# Altium schematic sheet top.SchDoc: GECKO3main: System overview
size A3; Organization: Berne University of Applied Science; Address1: School of Engineering and; Address2: Information Technology; Address3: Quellgasse 21; Address4: CH-2501 Biel; Revision: 1.0; SheetNumber: 1; SheetTotal: 19; ApprovedBy: zem1; Author: zac1
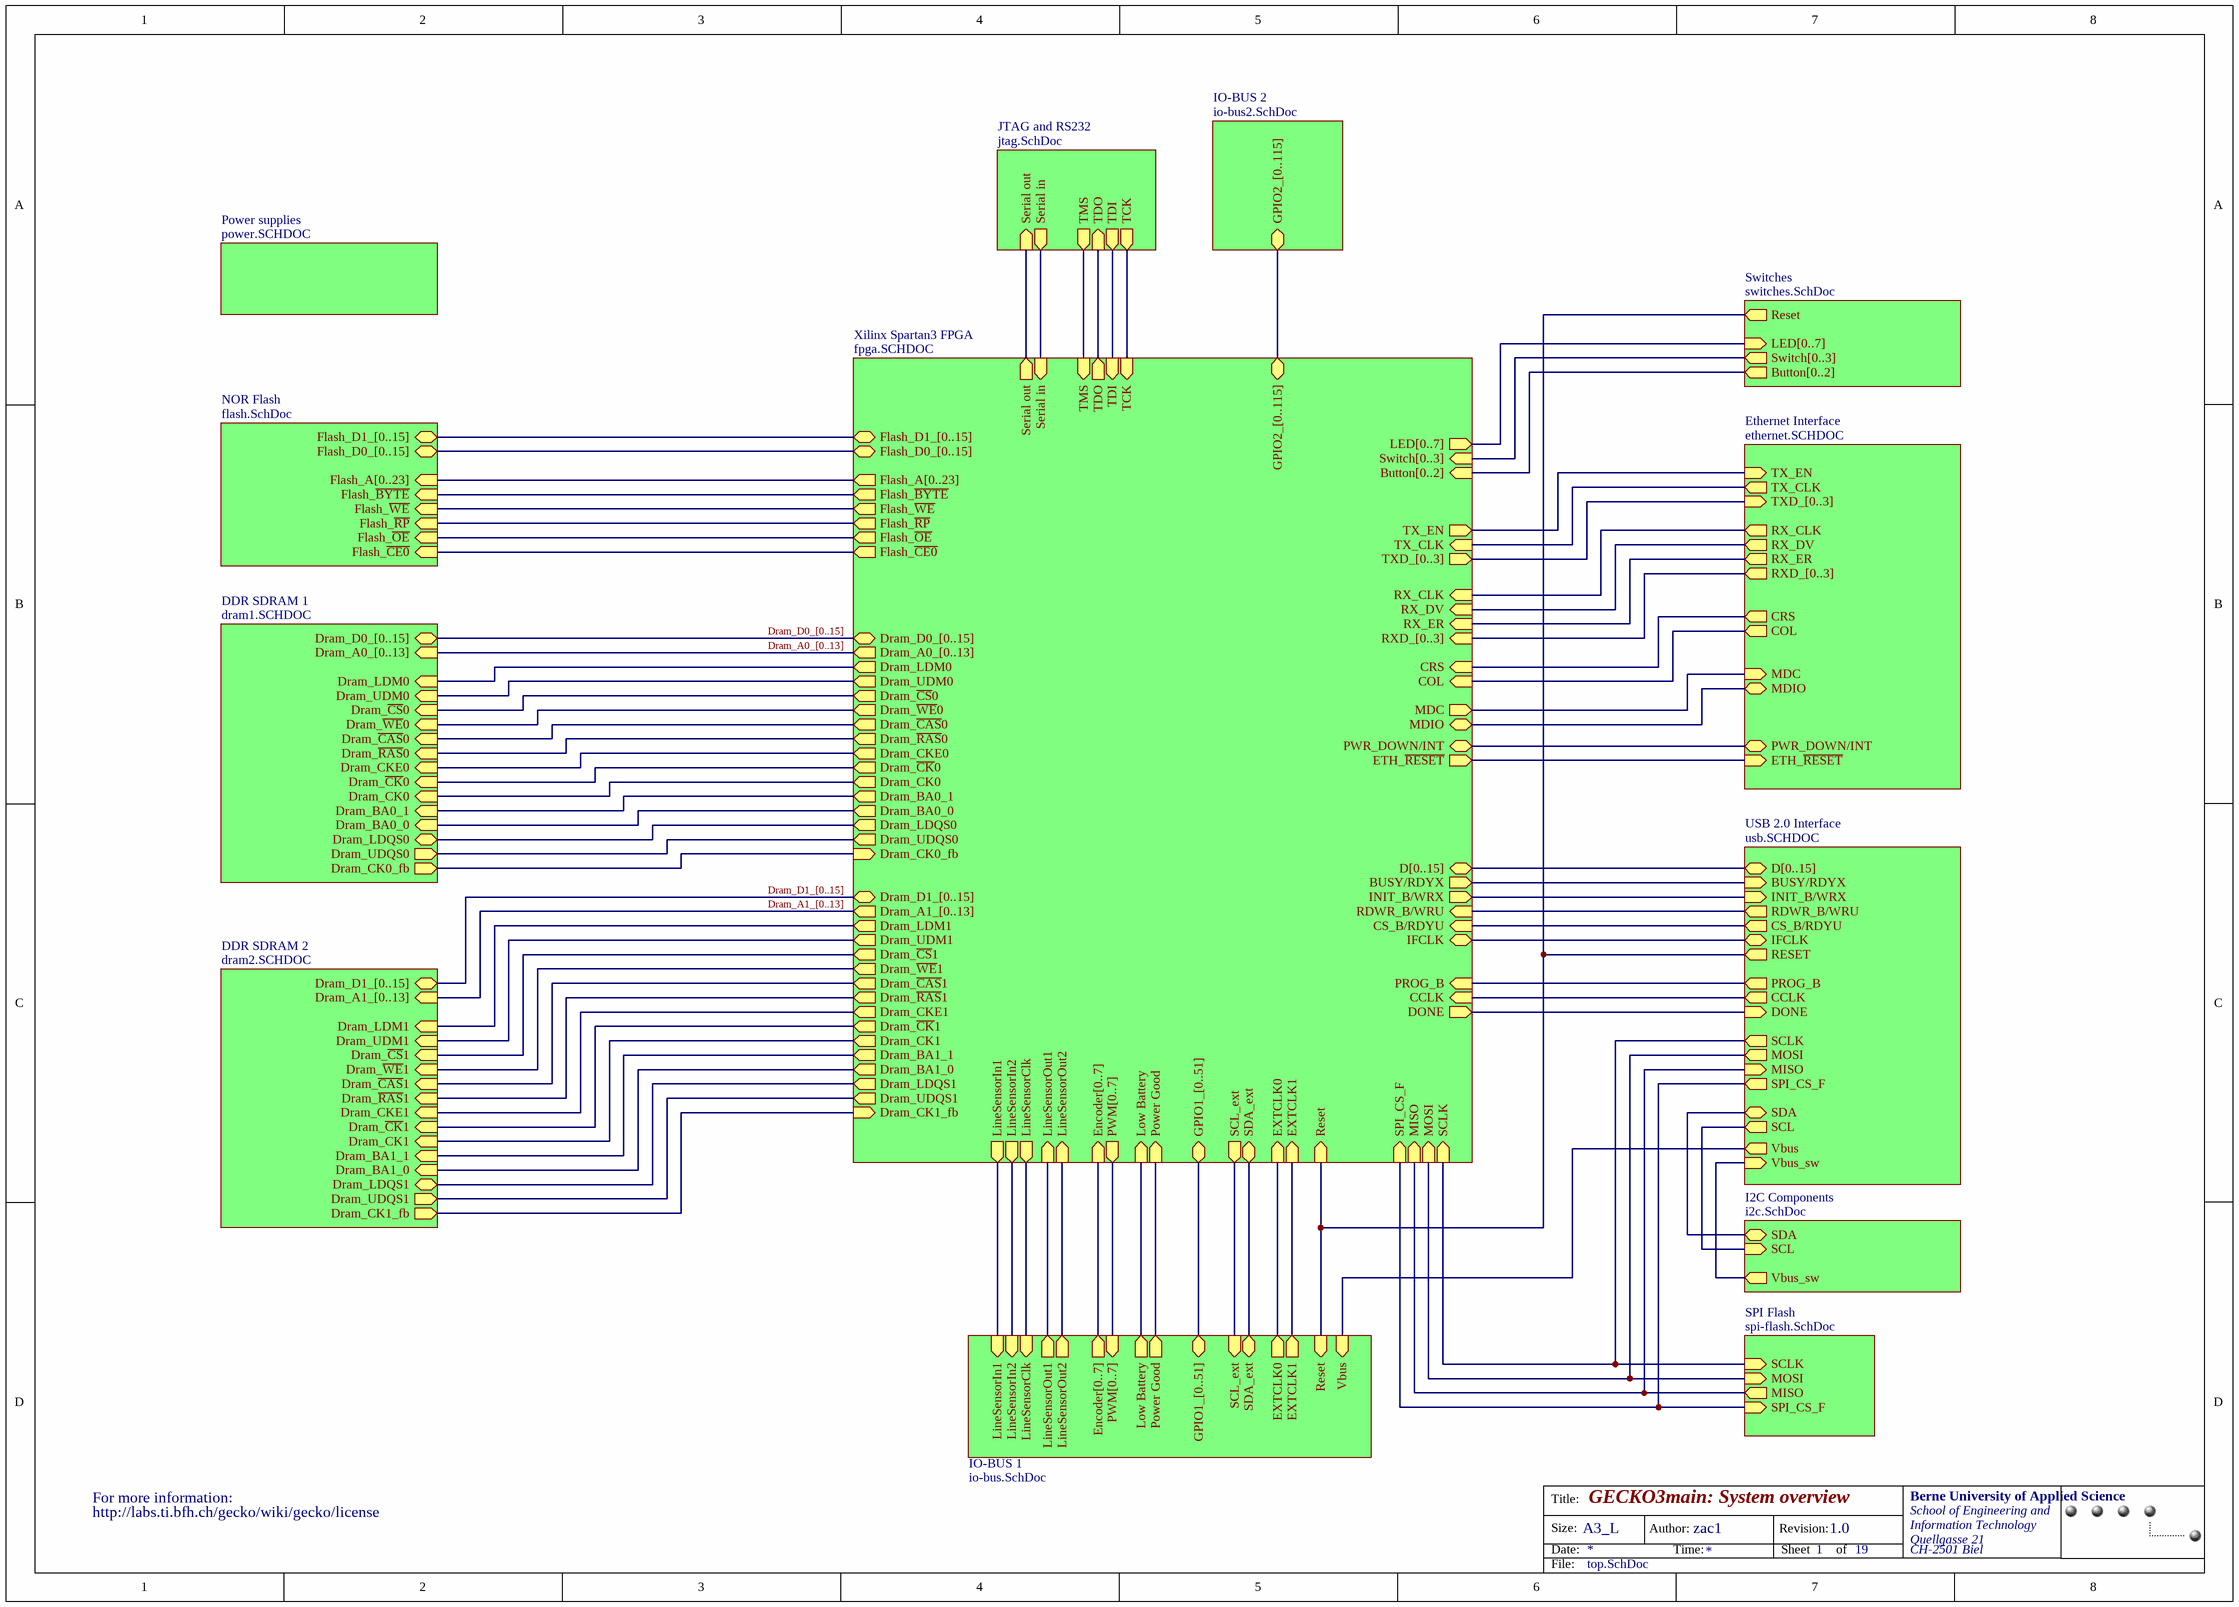
[diagram p0: top.SchDoc]

## Parts
1  (no value)  [CC-License]

## Sub-sheets
DDR SDRAM 1 = dram1.SCHDOC: Dram_D0_[0..15] (bidir), Dram_A0_[0..13] (in), Dram_LDM0 (in), Dram_UDM0 (in), Dram_~{CS}0 (in), Dram_~{WE}0 (in), Dram_~{CAS}0 (in), Dram_~{RAS}0 (in), Dram_CKE0 (in), Dram_~{CK}0 (in), Dram_CK0 (in), Dram_BA0_1 (in), Dram_BA0_0 (in), Dram_LDQS0 (bidir), Dram_UDQS0 (out), Dram_CK0_fb (out)
DDR SDRAM 2 = dram2.SCHDOC: Dram_D1_[0..15] (bidir), Dram_A1_[0..13] (in), Dram_LDM1 (in), Dram_UDM1 (in), Dram_~{CS}1 (in), Dram_~{WE}1 (in), Dram_~{CAS}1 (in), Dram_~{RAS}1 (in), Dram_CKE1 (in), Dram_~{CK}1 (in), Dram_CK1 (in), Dram_BA1_1 (in), Dram_BA1_0 (in), Dram_LDQS1 (bidir), Dram_UDQS1 (out), Dram_CK1_fb (out)
Ethernet Interface = ethernet.SCHDOC: PWR_DOWN/INT (bidir), ETH_~{RESET} (in), TX_CLK (out), RXD_[0..3] (out), RX_CLK (out), RX_DV (out), RX_ER (out), CRS (out), COL (out), TX_EN (in), TXD_[0..3] (in), MDC (in), MDIO (bidir)
I2C Components = i2c.SchDoc: SDA (bidir), SCL (in), Vbus_sw (out)
IO-BUS 1 = io-bus.SchDoc: Vbus (in), PWM[0..7] (in), GPIO1_[0..51] (bidir), Encoder[0..7] (out), Power Good (out), Low Battery (out), SDA_ext (bidir), Reset (in), SCL_ext (in), EXTCLK0 (out), EXTCLK1 (out), LineSensorOut2 (out), LineSensorOut1 (out), LineSensorIn2 (in), LineSensorClk (in), LineSensorIn1 (in)
IO-BUS 2 = io-bus2.SchDoc: GPIO2_[0..115] (bidir)
JTAG and RS232 = jtag.SchDoc: TCK (out), TDI (out), TMS (out), TDO (in), Serial out (in), Serial in (out)
NOR Flash = flash.SchDoc: Flash_A[0..23] (in), Flash_~{BYTE} (in), Flash_~{WE} (in), Flash_~{RP} (in), Flash_~{OE} (in), Flash_~{CE0} (in), Flash_D0_[0..15] (bidir), Flash_D1_[0..15] (bidir)
Power supplies = power.SCHDOC: no entries
SPI Flash = spi-flash.SchDoc: MOSI (in), SPI_CS_F (in), SCLK (in), MISO (out)
Switches = switches.SchDoc: LED[0..7] (in), Button[0..2] (out), Switch[0..3] (out), Reset (out)
USB 2.0 Interface = usb.SCHDOC: D[0..15] (bidir), Vbus (out), DONE (in), INIT_B/WRX (in), PROG_B (out), RDWR_B/WRU (out), BUSY/RDYX (in), RESET (out), CS_B/RDYU (out), CCLK (out), MISO (in), SPI_CS_F (out), MOSI (out), SCLK (out), SDA (bidir), SCL (out), Vbus_sw (in), IFCLK (bidir)
Xilinx Spartan3 FPGA = fpga.SCHDOC: PWR_DOWN/INT (bidir), ETH_~{RESET} (out), Flash_D1_[0..15] (bidir), Power Good (in), Low Battery (in), Flash_D0_[0..15] (bidir), Flash_~{BYTE} (out), Flash_~{WE} (out), Flash_~{RP} (out), Flash_~{OE} (out), Flash_~{CE0} (out), SDA_ext (bidir), SCL_ext (out), PWM[0..7] (out), GPIO1_[0..51] (bidir), Encoder[0..7] (in), GPIO2_[0..115] (bidir), Flash_A[0..23] (out), MOSI (in), SCLK (in), MISO (in), SPI_CS_F (in), Dram_D1_[0..15] (bidir), Dram_A1_[0..13] (out), Dram_LDM1 (out), Dram_UDM1 (out), Dram_~{CS}1 (out), Dram_~{WE}1 (out), Dram_~{CAS}1 (out), Dram_~{RAS}1 (out), Dram_CKE1 (out), Dram_~{CK}1 (out), Dram_CK1 (out), Dram_BA1_1 (out), Dram_BA1_0 (out), Dram_LDQS1 (out), Dram_UDQS1 (out), LED[0..7] (out), Button[0..2] (in), Switch[0..3] (in), TX_CLK (in), RXD_[0..3] (in), RX_CLK (in), RX_DV (in), RX_ER (in), CRS (in), COL (in), TX_EN (out), TXD_[0..3] (out), MDC (out), MDIO (bidir), D[0..15] (bidir), DONE (out), INIT_B/WRX (out), PROG_B (in), RDWR_B/WRU (in), BUSY/RDYX (out), CS_B/RDYU (in), CCLK (in), Dram_D0_[0..15] (bidir), Dram_A0_[0..13] (out), Dram_LDM0 (out), Dram_UDM0 (out), Dram_~{CS}0 (out), Dram_~{WE}0 (out), Dram_~{CAS}0 (out), Dram_~{RAS}0 (out), Dram_CKE0 (out), Dram_~{CK}0 (out), Dram_CK0 (out), Dram_BA0_1 (out), Dram_BA0_0 (out), Dram_LDQS0 (out), Dram_UDQS0 (out), EXTCLK0 (in), EXTCLK1 (in), TCK (in), TDI (in), TMS (in), TDO (out), Serial out (out), Serial in (in), Reset (in), IFCLK (bidir), Dram_CK1_fb (in), Dram_CK0_fb (in), LineSensorOut2 (in), LineSensorOut1 (in), LineSensorIn2 (out), LineSensorClk (out), LineSensorIn1 (out)

## Nets
(unnamed): sheet Xilinx Spartan3 FPGA/PWR_DOWN/INT, sheet Ethernet Interface/PWR_DOWN/INT
(unnamed): sheet Xilinx Spartan3 FPGA/ETH_~{RESET}, sheet Ethernet Interface/ETH_~{RESET}
(unnamed): sheet Xilinx Spartan3 FPGA/Power Good, sheet IO-BUS 1/Power Good
(unnamed): sheet Xilinx Spartan3 FPGA/Low Battery, sheet IO-BUS 1/Low Battery
(unnamed): sheet Xilinx Spartan3 FPGA/Flash_~{BYTE}, sheet NOR Flash/Flash_~{BYTE}
(unnamed): sheet Xilinx Spartan3 FPGA/Flash_~{WE}, sheet NOR Flash/Flash_~{WE}
(unnamed): sheet Xilinx Spartan3 FPGA/Flash_~{RP}, sheet NOR Flash/Flash_~{RP}
(unnamed): sheet Xilinx Spartan3 FPGA/Flash_~{OE}, sheet NOR Flash/Flash_~{OE}
(unnamed): sheet Xilinx Spartan3 FPGA/Flash_~{CE0}, sheet NOR Flash/Flash_~{CE0}
(unnamed): sheet Xilinx Spartan3 FPGA/SDA_ext, sheet IO-BUS 1/SDA_ext
(unnamed): sheet Xilinx Spartan3 FPGA/SCL_ext, sheet IO-BUS 1/SCL_ext
(unnamed): sheet Xilinx Spartan3 FPGA/MOSI, sheet SPI Flash/MOSI, sheet USB 2.0 Interface/MOSI
(unnamed): sheet Xilinx Spartan3 FPGA/SCLK, sheet SPI Flash/SCLK, sheet USB 2.0 Interface/SCLK
(unnamed): sheet Xilinx Spartan3 FPGA/MISO, sheet SPI Flash/MISO, sheet USB 2.0 Interface/MISO
(unnamed): sheet Xilinx Spartan3 FPGA/SPI_CS_F, sheet SPI Flash/SPI_CS_F, sheet USB 2.0 Interface/SPI_CS_F
(unnamed): sheet Xilinx Spartan3 FPGA/Dram_LDM1, sheet DDR SDRAM 2/Dram_LDM1
(unnamed): sheet Xilinx Spartan3 FPGA/Dram_UDM1, sheet DDR SDRAM 2/Dram_UDM1
(unnamed): sheet Xilinx Spartan3 FPGA/Dram_~{CS}1, sheet DDR SDRAM 2/Dram_~{CS}1
(unnamed): sheet Xilinx Spartan3 FPGA/Dram_~{WE}1, sheet DDR SDRAM 2/Dram_~{WE}1
(unnamed): sheet Xilinx Spartan3 FPGA/Dram_~{CAS}1, sheet DDR SDRAM 2/Dram_~{CAS}1
(unnamed): sheet Xilinx Spartan3 FPGA/Dram_~{RAS}1, sheet DDR SDRAM 2/Dram_~{RAS}1
(unnamed): sheet Xilinx Spartan3 FPGA/Dram_CKE1, sheet DDR SDRAM 2/Dram_CKE1
(unnamed): sheet Xilinx Spartan3 FPGA/Dram_~{CK}1, sheet DDR SDRAM 2/Dram_~{CK}1
(unnamed): sheet Xilinx Spartan3 FPGA/Dram_CK1, sheet DDR SDRAM 2/Dram_CK1
(unnamed): sheet Xilinx Spartan3 FPGA/Dram_BA1_1, sheet DDR SDRAM 2/Dram_BA1_1
(unnamed): sheet Xilinx Spartan3 FPGA/Dram_BA1_0, sheet DDR SDRAM 2/Dram_BA1_0
(unnamed): sheet Xilinx Spartan3 FPGA/Dram_LDQS1, sheet DDR SDRAM 2/Dram_LDQS1
(unnamed): sheet Xilinx Spartan3 FPGA/Dram_UDQS1, sheet DDR SDRAM 2/Dram_UDQS1
(unnamed): sheet Xilinx Spartan3 FPGA/TX_CLK, sheet Ethernet Interface/TX_CLK
(unnamed): sheet Xilinx Spartan3 FPGA/RX_CLK, sheet Ethernet Interface/RX_CLK
(unnamed): sheet Xilinx Spartan3 FPGA/RX_DV, sheet Ethernet Interface/RX_DV
(unnamed): sheet Xilinx Spartan3 FPGA/RX_ER, sheet Ethernet Interface/RX_ER
(unnamed): sheet Xilinx Spartan3 FPGA/CRS, sheet Ethernet Interface/CRS
(unnamed): sheet Xilinx Spartan3 FPGA/COL, sheet Ethernet Interface/COL
(unnamed): sheet Xilinx Spartan3 FPGA/TX_EN, sheet Ethernet Interface/TX_EN
(unnamed): sheet Xilinx Spartan3 FPGA/MDC, sheet Ethernet Interface/MDC
(unnamed): sheet Xilinx Spartan3 FPGA/MDIO, sheet Ethernet Interface/MDIO
(unnamed): sheet Xilinx Spartan3 FPGA/DONE, sheet USB 2.0 Interface/DONE
(unnamed): sheet Xilinx Spartan3 FPGA/INIT_B/WRX, sheet USB 2.0 Interface/INIT_B/WRX
(unnamed): sheet Xilinx Spartan3 FPGA/PROG_B, sheet USB 2.0 Interface/PROG_B
(unnamed): sheet Xilinx Spartan3 FPGA/RDWR_B/WRU, sheet USB 2.0 Interface/RDWR_B/WRU
(unnamed): sheet Xilinx Spartan3 FPGA/BUSY/RDYX, sheet USB 2.0 Interface/BUSY/RDYX
(unnamed): sheet Xilinx Spartan3 FPGA/CS_B/RDYU, sheet USB 2.0 Interface/CS_B/RDYU
(unnamed): sheet Xilinx Spartan3 FPGA/CCLK, sheet USB 2.0 Interface/CCLK
(unnamed): sheet Xilinx Spartan3 FPGA/Dram_LDM0, sheet DDR SDRAM 1/Dram_LDM0
(unnamed): sheet Xilinx Spartan3 FPGA/Dram_UDM0, sheet DDR SDRAM 1/Dram_UDM0
(unnamed): sheet Xilinx Spartan3 FPGA/Dram_~{CS}0, sheet DDR SDRAM 1/Dram_~{CS}0
(unnamed): sheet Xilinx Spartan3 FPGA/Dram_~{WE}0, sheet DDR SDRAM 1/Dram_~{WE}0
(unnamed): sheet Xilinx Spartan3 FPGA/Dram_~{CAS}0, sheet DDR SDRAM 1/Dram_~{CAS}0
(unnamed): sheet Xilinx Spartan3 FPGA/Dram_~{RAS}0, sheet DDR SDRAM 1/Dram_~{RAS}0
(unnamed): sheet Xilinx Spartan3 FPGA/Dram_CKE0, sheet DDR SDRAM 1/Dram_CKE0
(unnamed): sheet Xilinx Spartan3 FPGA/Dram_~{CK}0, sheet DDR SDRAM 1/Dram_~{CK}0
(unnamed): sheet Xilinx Spartan3 FPGA/Dram_CK0, sheet DDR SDRAM 1/Dram_CK0
(unnamed): sheet Xilinx Spartan3 FPGA/Dram_BA0_1, sheet DDR SDRAM 1/Dram_BA0_1
(unnamed): sheet Xilinx Spartan3 FPGA/Dram_BA0_0, sheet DDR SDRAM 1/Dram_BA0_0
(unnamed): sheet Xilinx Spartan3 FPGA/Dram_LDQS0, sheet DDR SDRAM 1/Dram_LDQS0
(unnamed): sheet Xilinx Spartan3 FPGA/Dram_UDQS0, sheet DDR SDRAM 1/Dram_UDQS0
(unnamed): sheet Xilinx Spartan3 FPGA/EXTCLK0, sheet IO-BUS 1/EXTCLK0
(unnamed): sheet Xilinx Spartan3 FPGA/EXTCLK1, sheet IO-BUS 1/EXTCLK1
(unnamed): sheet Xilinx Spartan3 FPGA/TCK, sheet JTAG and RS232/TCK
(unnamed): sheet Xilinx Spartan3 FPGA/TDI, sheet JTAG and RS232/TDI
(unnamed): sheet Xilinx Spartan3 FPGA/TMS, sheet JTAG and RS232/TMS
(unnamed): sheet Xilinx Spartan3 FPGA/TDO, sheet JTAG and RS232/TDO
(unnamed): sheet Xilinx Spartan3 FPGA/Serial out, sheet JTAG and RS232/Serial out
(unnamed): sheet Xilinx Spartan3 FPGA/Serial in, sheet JTAG and RS232/Serial in
(unnamed): sheet Xilinx Spartan3 FPGA/Reset, sheet IO-BUS 1/Reset, sheet Switches/Reset, sheet USB 2.0 Interface/RESET
(unnamed): sheet Xilinx Spartan3 FPGA/IFCLK, sheet USB 2.0 Interface/IFCLK
(unnamed): sheet Xilinx Spartan3 FPGA/Dram_CK1_fb, sheet DDR SDRAM 2/Dram_CK1_fb
(unnamed): sheet Xilinx Spartan3 FPGA/Dram_CK0_fb, sheet DDR SDRAM 1/Dram_CK0_fb
(unnamed): sheet Xilinx Spartan3 FPGA/LineSensorOut2, sheet IO-BUS 1/LineSensorOut2
(unnamed): sheet Xilinx Spartan3 FPGA/LineSensorOut1, sheet IO-BUS 1/LineSensorOut1
(unnamed): sheet Xilinx Spartan3 FPGA/LineSensorIn2, sheet IO-BUS 1/LineSensorIn2
(unnamed): sheet Xilinx Spartan3 FPGA/LineSensorClk, sheet IO-BUS 1/LineSensorClk
(unnamed): sheet Xilinx Spartan3 FPGA/LineSensorIn1, sheet IO-BUS 1/LineSensorIn1
(unnamed): sheet I2C Components/SDA, sheet USB 2.0 Interface/SDA
(unnamed): sheet I2C Components/SCL, sheet USB 2.0 Interface/SCL
(unnamed): sheet I2C Components/Vbus_sw, sheet USB 2.0 Interface/Vbus_sw
(unnamed): sheet IO-BUS 1/Vbus, sheet USB 2.0 Interface/Vbus

## Buses and harness runs
bus Dram_A0_[0..13] = sheet DDR SDRAM 1/Dram_A0_[0..13] = sheet Xilinx Spartan3 FPGA/Dram_A0_[0..13]
bus Dram_A1_[0..13] = sheet DDR SDRAM 2/Dram_A1_[0..13] = sheet Xilinx Spartan3 FPGA/Dram_A1_[0..13]
bus Dram_D0_[0..15] = sheet DDR SDRAM 1/Dram_D0_[0..15] = sheet Xilinx Spartan3 FPGA/Dram_D0_[0..15]
bus Dram_D1_[0..15] = sheet DDR SDRAM 2/Dram_D1_[0..15] = sheet Xilinx Spartan3 FPGA/Dram_D1_[0..15]
bus sheet Ethernet Interface/RXD_[0..3] = sheet Xilinx Spartan3 FPGA/RXD_[0..3]
bus sheet Ethernet Interface/TXD_[0..3] = sheet Xilinx Spartan3 FPGA/TXD_[0..3]
bus sheet IO-BUS 1/Encoder[0..7] = sheet Xilinx Spartan3 FPGA/Encoder[0..7]
bus sheet IO-BUS 1/GPIO1_[0..51] = sheet Xilinx Spartan3 FPGA/GPIO1_[0..51]
bus sheet IO-BUS 1/PWM[0..7] = sheet Xilinx Spartan3 FPGA/PWM[0..7]
bus sheet IO-BUS 2/GPIO2_[0..115] = sheet Xilinx Spartan3 FPGA/GPIO2_[0..115]
bus sheet NOR Flash/Flash_A[0..23] = sheet Xilinx Spartan3 FPGA/Flash_A[0..23]
bus sheet NOR Flash/Flash_D0_[0..15] = sheet Xilinx Spartan3 FPGA/Flash_D0_[0..15]
bus sheet NOR Flash/Flash_D1_[0..15] = sheet Xilinx Spartan3 FPGA/Flash_D1_[0..15]
bus sheet Switches/Button[0..2] = sheet Xilinx Spartan3 FPGA/Button[0..2]
bus sheet Switches/LED[0..7] = sheet Xilinx Spartan3 FPGA/LED[0..7]
bus sheet Switches/Switch[0..3] = sheet Xilinx Spartan3 FPGA/Switch[0..3]
bus sheet USB 2.0 Interface/D[0..15] = sheet Xilinx Spartan3 FPGA/D[0..15]

## Notes on the sheet
- (near 1) http://labs.ti.bfh.ch/gecko/wiki/gecko/license
- (near 1) For more information:
- Title:
- Size:
- Date:
- A3_L
- Author:
- Time:
- Revision:
- Sheet
- of
- File:

## Library data of the parts
1 = CC License